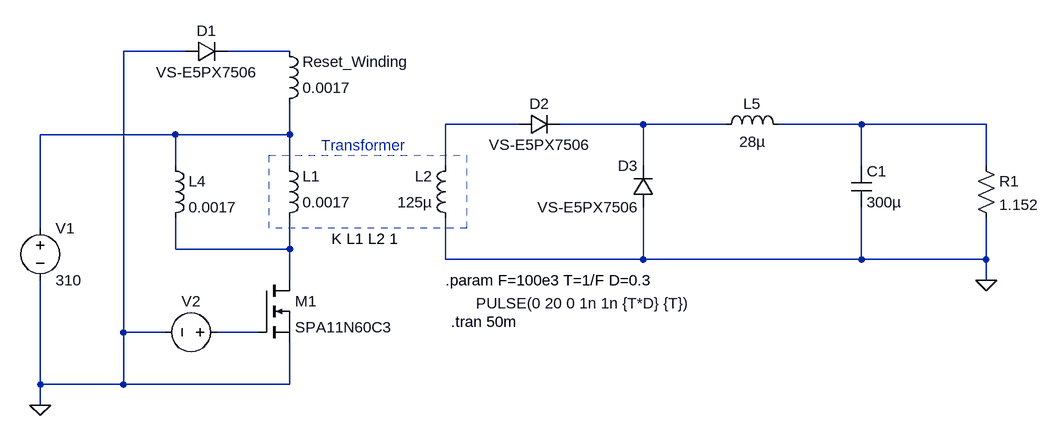
[diagram p0: schematic forward_converter_v2.asc]
forward_converter_v2.asc, the LTspice schematic file:
Version 4.1
SHEET 1 1376 680
WIRE 48 -112 -48 -112
WIRE 208 -112 112 -112
WIRE 560 0 448 0
WIRE 752 0 624 0
WIRE 880 0 752 0
WIRE 1088 0 960 0
WIRE 1280 0 1088 0
WIRE 32 16 -176 16
WIRE 208 16 208 -32
WIRE 208 16 32 16
WIRE 32 64 32 16
WIRE 208 64 208 16
WIRE 448 64 448 0
WIRE 752 64 752 0
WIRE 1088 64 1088 0
WIRE 1280 64 1280 0
WIRE -176 160 -176 16
WIRE 32 192 32 144
WIRE 208 192 208 144
WIRE 208 192 32 192
WIRE 448 208 448 144
WIRE 752 208 752 128
WIRE 752 208 448 208
WIRE 1088 208 1088 128
WIRE 1088 208 752 208
WIRE 1280 208 1280 144
WIRE 1280 208 1088 208
WIRE 208 240 208 192
WIRE 1280 240 1280 208
WIRE -48 320 -48 -112
WIRE 16 320 -48 320
WIRE 160 320 96 320
WIRE -176 400 -176 240
WIRE -48 400 -48 320
WIRE -48 400 -176 400
WIRE 208 400 208 336
WIRE 208 400 -48 400
WIRE -176 432 -176 400
FLAG -176 432 0
FLAG 1280 240 0
SYMBOL voltage -176 144 R0
WINDOW 123 0 0 Left 0
WINDOW 39 0 0 Left 0
SYMATTR InstName V1
SYMATTR Value 310
SYMBOL ind 192 160 M180
WINDOW 0 36 80 Left 2
WINDOW 3 36 40 Left 2
SYMATTR InstName L1
SYMATTR Value 0.0017
SYMBOL ind 464 160 R180
WINDOW 0 36 80 Left 2
WINDOW 3 36 40 Left 2
SYMATTR InstName L2
SYMATTR Value 125µ
SYMBOL ind 192 -16 M180
WINDOW 0 36 80 Left 2
WINDOW 3 36 40 Left 2
SYMATTR InstName Reset_Winding
SYMATTR Value 0.0017
SYMBOL ind 16 48 R0
SYMATTR InstName L4
SYMATTR Value 0.0017
SYMBOL nmos 160 240 R0
SYMATTR InstName M1
SYMATTR Value SPA11N60C3
SYMBOL voltage 112 320 R90
WINDOW 0 -32 56 VBottom 2
WINDOW 3 -60 -549 VTop 2
WINDOW 123 0 0 Left 0
WINDOW 39 0 0 Left 0
SYMATTR InstName V2
SYMATTR Value PULSE(0 20 0 1n 1n {T*D} {T})
SYMBOL ind 864 16 R270
WINDOW 0 32 56 VTop 2
WINDOW 3 5 56 VBottom 2
SYMATTR InstName L5
SYMATTR Value 28µ
SYMBOL cap 1072 64 R0
SYMATTR InstName C1
SYMATTR Value 300µ
SYMBOL res 1264 48 R0
SYMATTR InstName R1
SYMATTR Value 1.152
SYMBOL diode 48 -96 R270
WINDOW 0 32 32 VTop 2
WINDOW 3 0 32 VBottom 2
SYMATTR InstName D1
SYMATTR Value VS-E5PX7506
SYMBOL diode 560 16 R270
WINDOW 0 32 32 VTop 2
WINDOW 3 0 32 VBottom 2
SYMATTR InstName D2
SYMATTR Value VS-E5PX7506
SYMBOL diode 768 128 R180
WINDOW 0 24 64 Left 2
WINDOW 3 24 0 Left 2
SYMATTR InstName D3
SYMATTR Value VS-E5PX7506
TEXT 272 176 Left 2 !K L1 L2 1
TEXT 448 240 Left 2 !.param F=100e3 T=1/F D=0.3
TEXT 456 304 Left 2 !.tran 50m
TEXT 256 32 Left 2 ;Transformer
RECTANGLE Normal 480 160 176 48 2

The netlist it stands for:
* forward_converter_v2.asc
V1 N005 0 310
L1 N006 N005 0.0017
L2 0 N002 125µ
L§Reset_Winding N005 N001 0.0017
L4 N005 N006 0.0017
M1 N006 N007 0 0 SPA11N60C3
V2 N007 0 PULSE(0 20 0 1n 1n {T*D} {T})
L5 N003 N004 28µ
C1 N004 0 300µ
R1 N004 0 1.152
D1 0 N001 VS-E5PX7506
D2 N002 N003 VS-E5PX7506
D3 0 N003 VS-E5PX7506
.model D D
.lib standard.dio
.model NMOS NMOS
.model PMOS PMOS
.lib standard.mos
K L1 L2 1
.param F=100e3 T=1/F D=0.3
.tran 50m
* Transformer
.backanno
.end